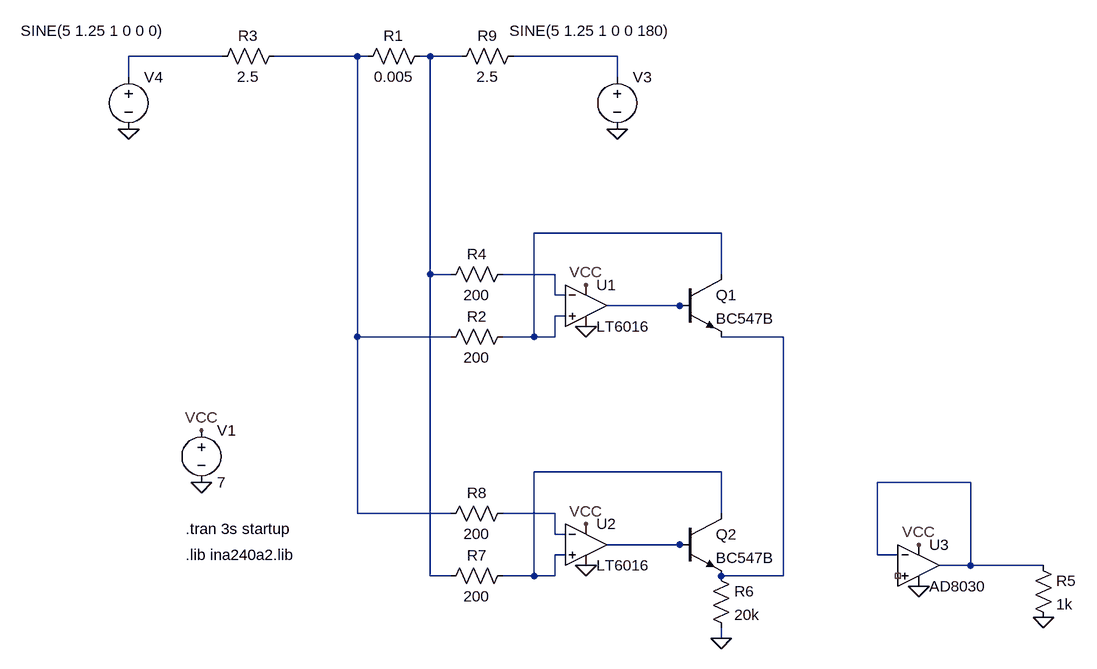
[diagram p0: schematic sim_current_sens_lt6016.asc]
sim_current_sens_lt6016.asc, the LTspice schematic file:
Version 4
SHEET 1 2464 1184
WIRE 0 160 -144 160
WIRE 208 160 80 160
WIRE 224 160 208 160
WIRE 320 160 304 160
WIRE 368 160 320 160
WIRE 608 160 448 160
WIRE -144 192 -144 160
WIRE 608 192 608 160
WIRE 768 432 480 432
WIRE 320 496 320 160
WIRE 352 496 320 496
WIRE 512 496 432 496
WIRE 768 496 768 432
WIRE 512 528 512 496
WIRE 528 528 512 528
WIRE 704 544 592 544
WIRE 720 544 704 544
WIRE 528 560 512 560
WIRE 208 592 208 160
WIRE 352 592 208 592
WIRE 480 592 480 432
WIRE 480 592 432 592
WIRE 512 592 512 560
WIRE 512 592 480 592
WIRE 864 592 768 592
WIRE 768 800 480 800
WIRE 1152 816 1008 816
WIRE 208 864 208 592
WIRE 352 864 208 864
WIRE 512 864 432 864
WIRE 768 864 768 800
WIRE 512 896 512 864
WIRE 528 896 512 896
WIRE 704 912 592 912
WIRE 720 912 704 912
WIRE 528 928 512 928
WIRE 1008 928 1008 816
WIRE 1040 928 1008 928
WIRE 1152 944 1152 816
WIRE 1152 944 1104 944
WIRE 1264 944 1152 944
WIRE 320 960 320 496
WIRE 352 960 320 960
WIRE 480 960 480 800
WIRE 480 960 432 960
WIRE 512 960 512 928
WIRE 512 960 480 960
WIRE 864 960 864 592
WIRE 864 960 768 960
WIRE 768 1056 768 1040
FLAG -32 736 VCC
FLAG -32 816 0
FLAG -144 272 0
FLAG 560 512 VCC
FLAG 560 576 0
FLAG 560 880 VCC
FLAG 560 944 0
FLAG 768 1056 0
FLAG 1072 976 0
FLAG 1072 912 VCC
FLAG 608 272 0
FLAG 1264 1024 0
SYMBOL res 320 144 R90
WINDOW 0 0 56 VBottom 2
WINDOW 3 32 56 VTop 2
SYMATTR InstName R1
SYMATTR Value 0.005
SYMBOL voltage -32 720 R0
SYMATTR InstName V1
SYMATTR Value 7
SYMATTR SpiceLine Rser=0.01
SYMBOL res 96 144 R90
WINDOW 0 0 56 VBottom 2
WINDOW 3 32 56 VTop 2
SYMATTR InstName R3
SYMATTR Value 2.5
SYMBOL res 448 576 R90
WINDOW 0 0 56 VBottom 2
WINDOW 3 32 56 VTop 2
SYMATTR InstName R2
SYMATTR Value 200
SYMBOL res 448 480 R90
WINDOW 0 0 56 VBottom 2
WINDOW 3 32 56 VTop 2
SYMATTR InstName R4
SYMATTR Value 200
SYMBOL res 448 944 R90
WINDOW 0 0 56 VBottom 2
WINDOW 3 32 56 VTop 2
SYMATTR InstName R7
SYMATTR Value 200
SYMBOL res 448 848 R90
WINDOW 0 0 56 VBottom 2
WINDOW 3 32 56 VTop 2
SYMATTR InstName R8
SYMATTR Value 200
SYMBOL OpAmps/LT6016 560 544 R0
SYMATTR InstName U1
SYMBOL OpAmps/LT6016 560 912 R0
SYMATTR InstName U2
SYMBOL res 752 944 R0
SYMATTR InstName R6
SYMATTR Value 20k
SYMBOL res 464 144 R90
WINDOW 0 0 56 VBottom 2
WINDOW 3 32 56 VTop 2
SYMATTR InstName R9
SYMATTR Value 2.5
SYMBOL voltage 608 176 R0
WINDOW 3 -166 -55 Left 2
SYMATTR Value SINE(5 1.25 1 0 0 180)
SYMATTR InstName V3
SYMATTR SpiceLine Rser=0
SYMBOL voltage -144 176 R0
WINDOW 3 -166 -55 Left 2
SYMATTR Value SINE(5 1.25 1 0 0 0)
SYMATTR InstName V4
SYMATTR SpiceLine Rser=0
SYMBOL npn 704 496 R0
SYMATTR InstName Q1
SYMATTR Value BC547B
SYMBOL npn 704 864 R0
SYMATTR InstName Q2
SYMATTR Value BC547B
SYMBOL res 1248 928 R0
SYMATTR InstName R5
SYMATTR Value 1k
SYMBOL OpAmps/AD8030 1072 880 R0
SYMATTR InstName U3
TEXT -56 928 Left 2 !.lib ina240a2.lib
TEXT -56 888 Left 2 !.tran 3s startup

The netlist it stands for:
* sim_current_sens_lt6016.asc
R1 N003 N002 0.005
V1 VCC 0 7 Rser=0.01
R3 N002 N001 2.5
R2 N005 N002 200
R4 N006 N003 200
R7 N009 N003 200
R8 N011 N002 200
* U1: LT6016 (symbol OpAmps/LT6016 not available, pins judged from their places): In+=N005 In-=N006 V+=VCC V-=0 OUT=N007
* U2: LT6016 (symbol OpAmps/LT6016 not available, pins judged from their places): In+=N009 In-=N011 V+=VCC V-=0 OUT=N012
R6 N008 0 20k
R9 N004 N003 2.5
V3 N004 0 SINE(5 1.25 1 0 0 180) Rser=0
V4 N001 0 SINE(5 1.25 1 0 0 0) Rser=0
Q1 N005 N007 N008 0 BC547B
Q2 N009 N012 N008 0 BC547B
R5 N010 0 1k
XU3 NC_01 N010 VCC 0 N010 AD8040  ; AD8030, pins In+ In- V+ V- OUT
.model NPN NPN
.model PNP PNP
.lib standard.bjt
.lib ina240a2.lib
.tran 3s startup
.lib ADI.lib
.backanno
.end